# EasyEDA schematic remote_glove_bluetooth_2021-02-27.json

## Sheets
1 Transceiver_scheme_hc05: TITLE: Sheet_1; REV: 1.0; Date: 2021-02-05; Sheet: 1/1; Drawn By: DaniRogachev; Company: Your Company
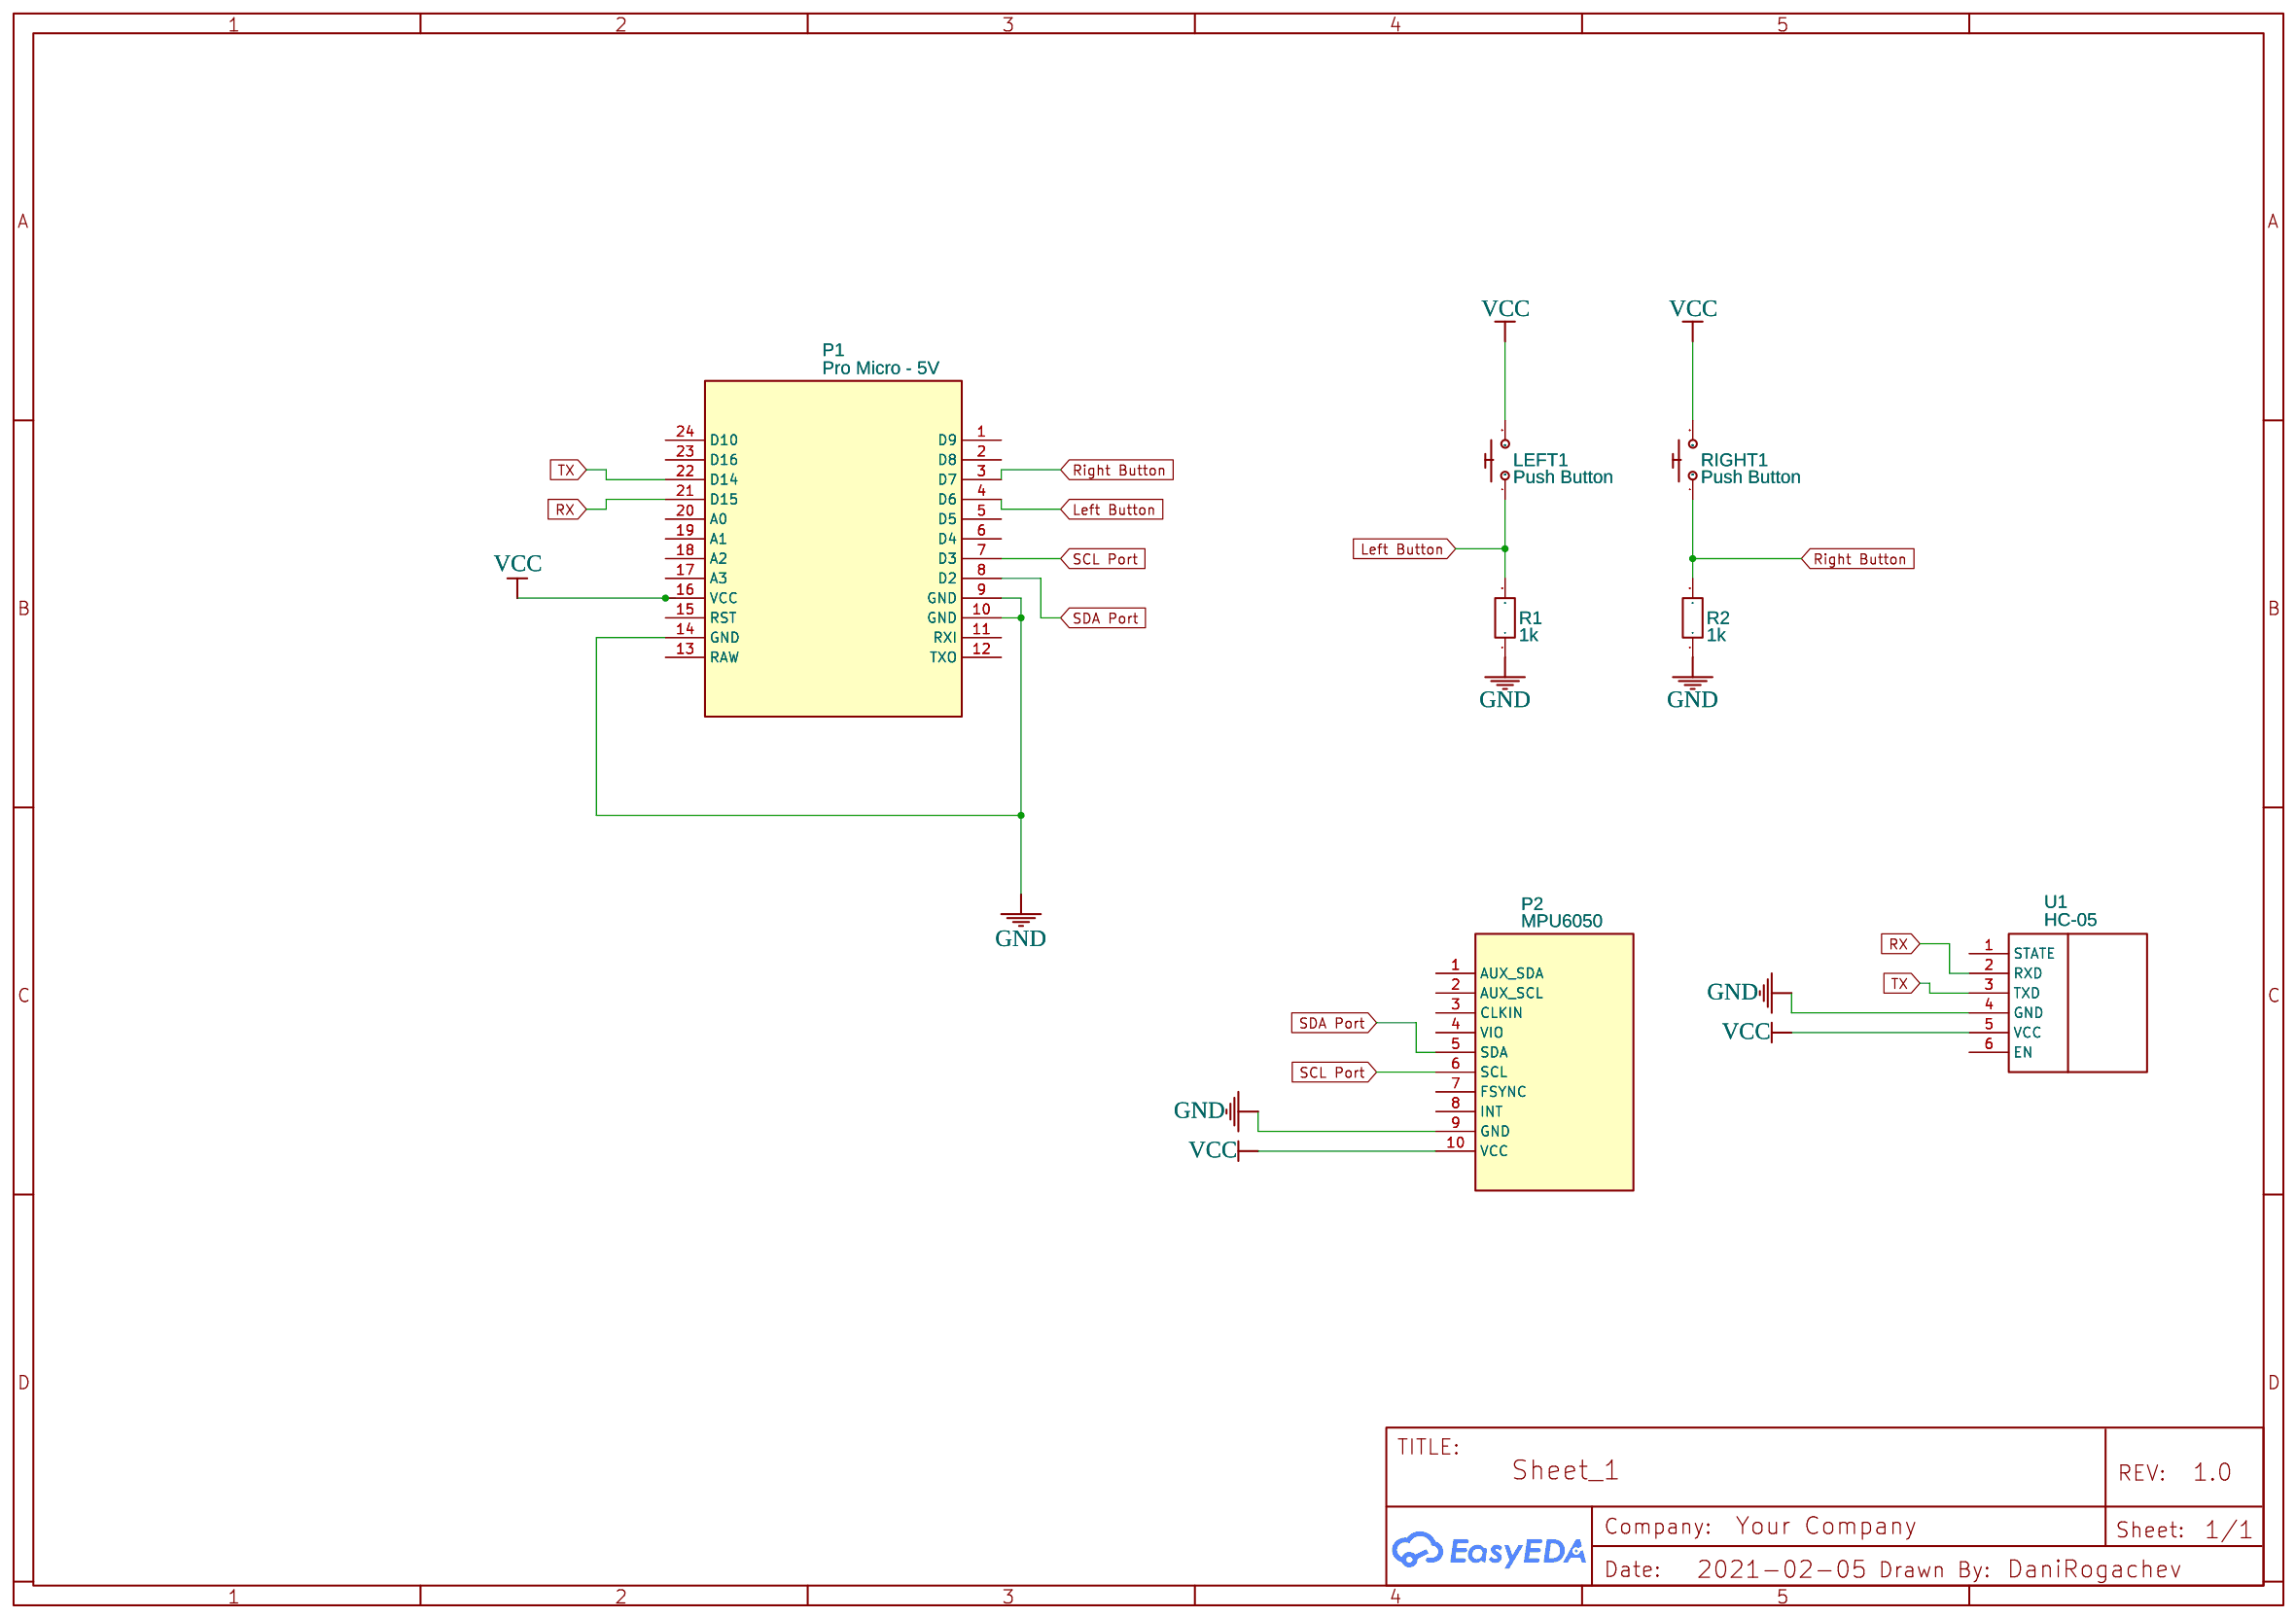
[diagram p0: Transceiver_scheme_hc05]
2 Receiver_scheme_hc06
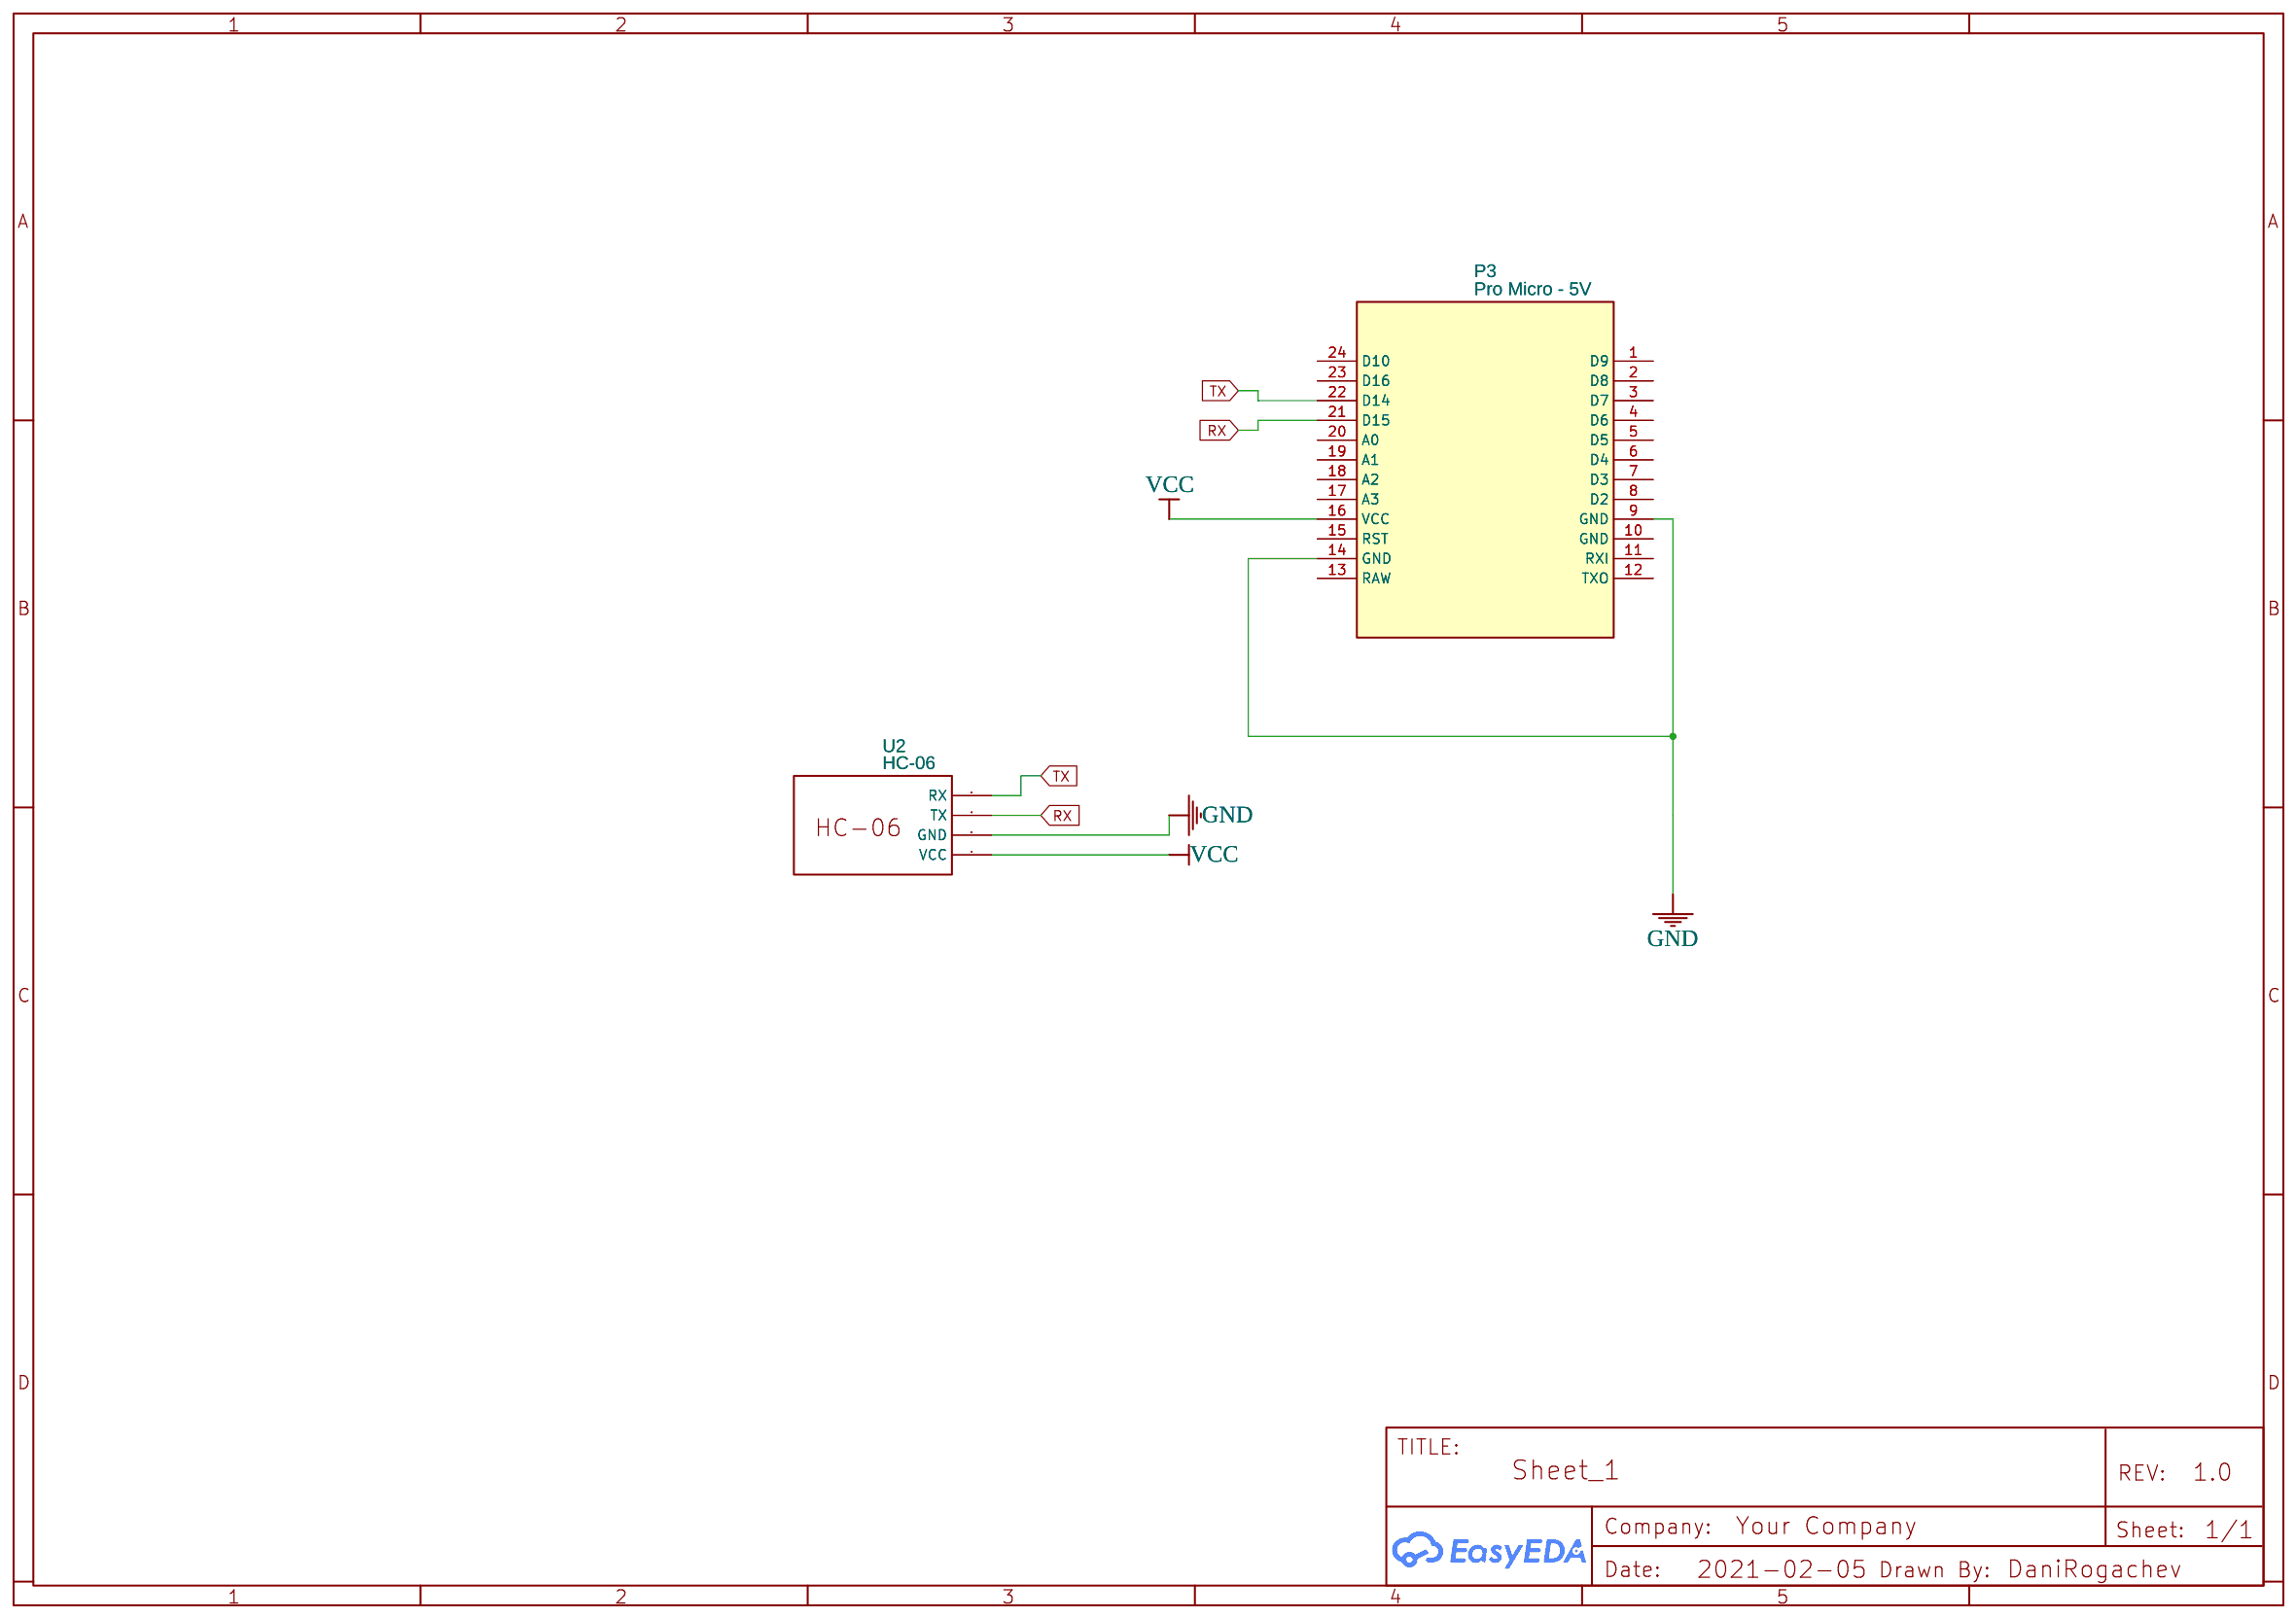
[diagram p1: Receiver_scheme_hc06]

## Parts
sheet Receiver_scheme_hc06
P3  Pro Micro - 5V  [PRO MICRO - 5V]
U2  HC-06  [HC-06]
sheet Transceiver_scheme_hc05
LEFT1  Push Button  [SMD-BUTTON]
P1  Pro Micro - 5V  [PRO MICRO - 5V]
P2  MPU6050  [MPU6050]
R1  1k  [R0603]
R2  1k  [R0603]
RIGHT1  Push Button  [SMD-BUTTON]
U1  HC-05

## Library data of the parts
P1 P3 = Pro Micro - 5V: sourceId: 1T5FDZYC8
U2 = HC-06: Contributor: nico.hampl1999; sourceId: 31jdvN5mE
LEFT1 RIGHT1 = Push Button: sourceId: M82WewO60; Supplier Part: COM-08720; Supplier: SparkFun
P2 = MPU6050: sourceId: 1T5FDZYC8
R1 R2 = R_0603_EU: Contributor: LCEDA_Lib
U1 = HC-05: Contributor: pavloklas

## Nets
GND: P1.9(GND) P1.10(GND) P1.14(GND) P2.9(GND) P3.9(GND) P3.14(GND) R1.1 R2.1 U1.4(GND) U2.3(GND)
VCC: LEFT1.2(P$2) P1.16(VCC) P2.10(VCC) P3.16(VCC) RIGHT1.2(P$2) U1.5(VCC) U2.4(VCC)
Left Button: LEFT1.1(P$1) P1.4(D6) R1.2
Right Button: P1.3(D7) R2.2 RIGHT1.1(P$1)
RX: P1.21(D15) P3.21(D15) U1.2(RXD) U2.2(TX)
SCL Port: P1.7(D3) P2.6(SCL)
SDA Port: P1.8(D2) P2.5(SDA)
TX: P1.22(D14) P3.22(D14) U1.3(TXD) U2.1(RX)

Not connected (* = marked no-connect by the designer): P1 1(D9) 2(D8) 5(D5) 6(D4) 11(RXI) 12(TXO) 13(RAW) 15(RST) 17(A3) 18(A2) 19(A1) 20(A0) 23(D16) 24(D10); P2 1(AUX_SDA) 2(AUX_SCL) 3(CLKIN) 4(VIO) 7(FSYNC) 8(INT); P3 1(D9) 2(D8) 3(D7) 4(D6) 5(D5) 6(D4) 7(D3) 8(D2) 10(GND) 11(RXI) 12(TXO) 13(RAW) 15(RST) 17(A3) 18(A2) 19(A1) 20(A0) 23(D16) 24(D10); U1 1(STATE) 6(EN)
